# Altium schematic sheet LCD.SchDoc: LCD
size A4; CompanyName: STMicroelectronics; Organization: Microcontrollers Division; DocumentNumber: 16; SheetNumber: 12; SheetTotal: 19
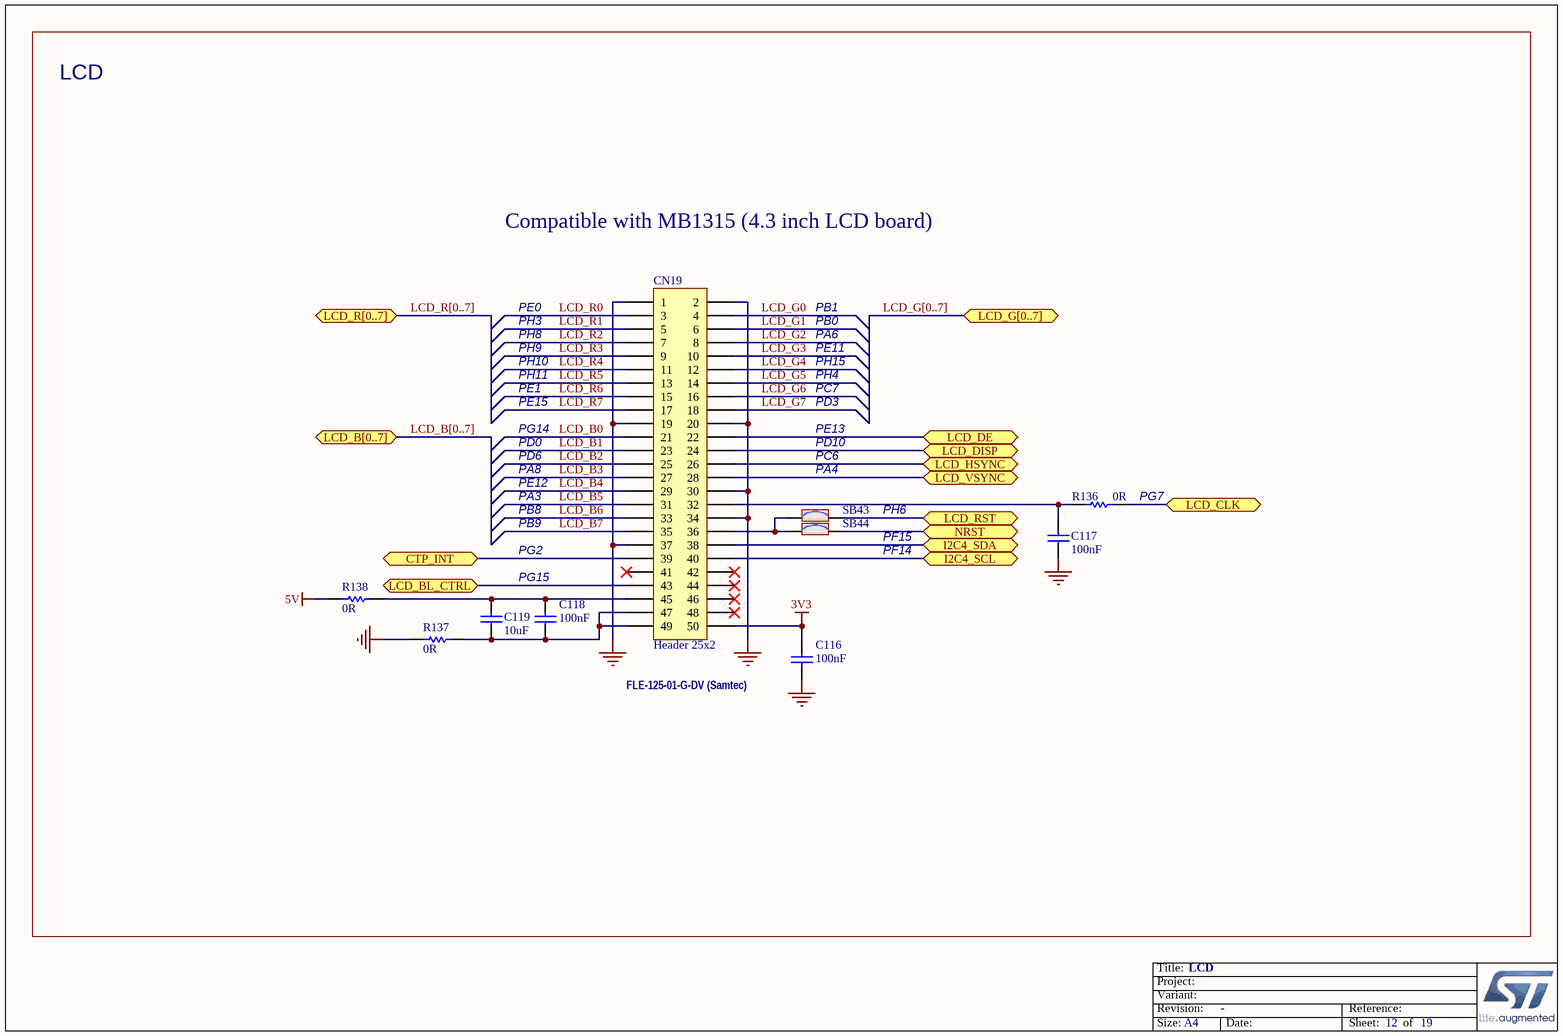
[diagram p0: LCD.SchDoc]

## Parts
C116  value 100nF  [C0402]  (hidden comment: Capacitor)
C117  value 100nF  [C0402]  (hidden comment: Capacitor)
C118  value 100nF  [C0402]  (hidden comment: Capacitor)
C119  value 10uF  [C0805]  (hidden comment: Capacitor)
CN19  Header 25x2  [MOD_LCD_MB1046B__CON_SAMTEC_FLE-125-01-G-DV]
R136  value 0R  [R0402]  (hidden comment: Resistor)
R137  value 0R  [R0603]  (hidden comment: Resistor)
R138  value 0R  [R0603]  (hidden comment: Resistor)
SB43  SB_ON  [SOLDER-BRIDGE_R0603-0R]  (value not drawn)
SB44  SB_ON  [SOLDER-BRIDGE_R0603-0R]  (value not drawn)

## Ports
CTP_INT, I2C4_SCL, I2C4_SDA, LCD_B[0..7], LCD_BL_CTRL, LCD_CLK, LCD_DE, LCD_DISP, LCD_G[0..7], LCD_HSYNC, LCD_R[0..7], LCD_RST, LCD_VSYNC, NRST

## Nets
3V3: C116.1 CN19.50
5V: R138.1
GND: C116.2 C117.1 CN19.1 CN19.2 CN19.19 CN19.20 CN19.30 CN19.34 CN19.37 R137.1
CTP_INT: CN19.39 ; port CTP_INT
I2C4_SCL: CN19.40 ; port I2C4_SCL
I2C4_SDA: CN19.38 ; port I2C4_SDA
LCD_B0: CN19.21
LCD_B1: CN19.23
LCD_B2: CN19.25
LCD_B3: CN19.27
LCD_B4: CN19.29
LCD_B5: CN19.31
LCD_B6: CN19.33
LCD_B7: CN19.35
LCD_BL_CTRL: CN19.43 ; port LCD_BL_CTRL
LCD_CLK: R136.2 ; port LCD_CLK
LCD_DE: CN19.22 ; port LCD_DE
LCD_DISP: CN19.24 ; port LCD_DISP
LCD_G0: CN19.4
LCD_G1: CN19.6
LCD_G2: CN19.8
LCD_G3: CN19.10
LCD_G4: CN19.12
LCD_G5: CN19.14
LCD_G6: CN19.16
LCD_G7: CN19.18
LCD_HSYNC: CN19.26 ; port LCD_HSYNC
LCD_R0: CN19.3
LCD_R1: CN19.5
LCD_R2: CN19.7
LCD_R3: CN19.9
LCD_R4: CN19.11
LCD_R5: CN19.13
LCD_R6: CN19.15
LCD_R7: CN19.17
LCD_RST: SB43.2 ; port LCD_RST
LCD_VSYNC: CN19.28 ; port LCD_VSYNC
NRST: SB44.2 ; port NRST
NetC117_2: C117.2 CN19.32 R136.1
NetC118_1: C118.1 C119.2 CN19.45 R138.2
NetC118_2: C118.2 C119.1 CN19.47 CN19.49 R137.2
NetCN19_36: CN19.36 SB43.1 SB44.1

Not connected (* = marked no-connect by the designer): CN19 41* 42* 44* 46* 48*

## Buses and harness runs
bus LCD_B[0..7] = port LCD_B[0..7]
bus LCD_G[0..7] = port LCD_G[0..7]
bus LCD_R[0..7] = port LCD_R[0..7]

## Notes on the sheet
- LCD
- Compatible with MB1315 (4.3 inch LCD board)
- PE0
- PB1
- PH3
- PH8
- PH9
- PH10
- PH11
- PA6
- PB0
- PE11
- PH15
- PH4
- PE1
- PD0
- PE15
- PG14
- PE13
- PD10
- PC7
- PD3
- PA3
- PA8
- PB8
- PD6
- PE12
- PA4
- PC6
- PH6
- (near R136) PG7
- PG2
- PG15
- PB9
- PF15
- PF14
- (near C116) FLE-125-01-G-DV (Samtec)
- Title:
- Project:
- Size:
- Revision:
- Variant:
- A4
- -
- Date:
- Reference:
- Sheet:
- of

## Library data of the parts
C116-C118 = MCD-00006: Capacitor, MLCC, 100nF, 16V, X7R, 10%, 0402, T=0.5mm; Manufacturer_Part_Number: CC0402KRX7R7BB104; Manufacturer: YAGEO; Provided_By: Subcon; Initial_Board_Reference: MB1274; Internal_Part_Number: MCD-00006; ECCN_US: n/a; ECCN_EU: n/a; ComponentLink1Description: Datasheet; Status: Released; Package: C0402; Part_Type: Capacitor; ComponentLink1URL: http://tunmcdsvn.tun.st.com/Component_Datasheet_Library/Trunk/Capacitors/Yageo_Multilayer_Capacitor_X7R_series_100pF_to_22uF
C119 = MCD-00014: Capacitor, MLCC, 10uF, 25V, X5R, 10%, 0805, T=0,85mm; Manufacturer_Part_Number: CC0805KRX5R8BB106; Manufacturer: YAGEO; Provided_By: Subcon; Initial_Board_Reference: MB1274; Internal_Part_Number: MCD-00014; Status: Released; Part_Type: Capacitor; Package: C0805; ComponentLink1Description: Datasheet; ComponentLink1URL: http://tunmcdsvn.tun.st.com/Component_Datasheet_Library/Trunk/Capacitors/Yageo_Multilayer_capacitor_X5R_series_100pF_to_100uF; ECCN_US: n/a; ECCN_EU: n/a
CN19 = MCD-01222: Header 25x2 for MB1046 - LCD 4.3 inches daughter board; Part_Type: Connector; Manufacturer_Part_Number: FLE-125-01-G-DV; Manufacturer: SAMTEC; Provided_By: SUBCO; Initial_Board_Reference: MB1332; Internal_Part_Number: MCD-01222; Value: Header 25x2; Status: Footprint available; ComponentLink1Description: Datasheet; ComponentLink1URL: http://tunmcdsvn.tun.st.com/Component_Datasheet_Library/Trunk/Connectors/Samtec_FLE_smt_series/
R136 = MCD-00052: Resistor,0R,0402,5%,1/16W; Manufacturer_Part_Number: RC0402JR-070RL; Manufacturer: YAGEO; ECCN_US: EAR99; ECCN_EU: NEC; Provided_By: SUBCO; Internal_Part_Number: MCD-00052; Status: Released; Part_Type: Resistor; Package: R0402; ComponentLink1Description: Datasheet; ComponentLink1URL: http://tunmcdsvn.tun.st.com/Component_Datasheet_Library/Trunk/Resistors/Yageo_Resistor_RC0402-series
R137 R138 = MCD-00056: Resistor,0R,0603,5%,1/10W; Manufacturer_Part_Number: RC0603JR-070RL; Manufacturer: YAGEO; Provided_By: subcon; Initial_Board_Reference: MB1274; Internal_Part_Number: MCD-00056; Status: Released; Part_Type: Resistor; Package: R0603; ComponentLink1Description: Datasheet; ComponentLink1URL: http://tunmcdsvn.tun.st.com/Component_Datasheet_Library/Trunk/Resistors/Yageo_Resistor_RC0603-series; ECCN_US: n/a; ECCN_EU: n/a
SB43 SB44 = MCD-00071: Solder Bridge ON; Part_Type: Mechanical; Manufacturer_Part_Number: RC0603JR-070RL; Manufacturer: YAGEO; Provided_By: SUBCO; Internal_Part_Number: MCD-00071; Status: Released; Package: SB0603; ComponentLink1Description: Datasheet; ComponentLink1URL: http://tunmcdsvn.tun.st.com/Component_Datasheet_Library/Trunk/Resistors/Yageo_Resistor_RC0603-series